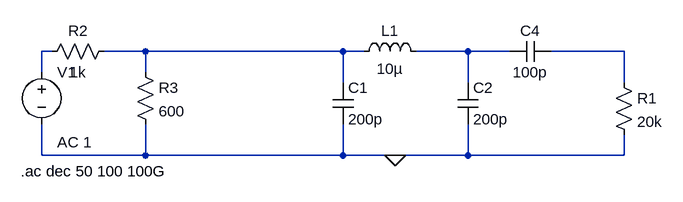
[diagram p0: schematic realim-colpits.asc]
realim-colpits.asc, the LTspice schematic file:
Version 4
SHEET 1 880 680
WIRE -320 64 -336 64
WIRE -176 64 -240 64
WIRE 128 64 -176 64
WIRE 160 64 128 64
WIRE 320 64 240 64
WIRE 384 64 320 64
WIRE 560 64 448 64
WIRE -336 96 -336 64
WIRE -176 96 -176 64
WIRE 128 112 128 64
WIRE 320 112 320 64
WIRE 560 112 560 64
WIRE -336 224 -336 176
WIRE -176 224 -176 176
WIRE -176 224 -336 224
WIRE 128 224 128 176
WIRE 128 224 -176 224
WIRE 208 224 128 224
WIRE 320 224 320 176
WIRE 320 224 208 224
WIRE 560 224 560 192
WIRE 560 224 320 224
FLAG 208 224 0
SYMBOL cap 112 112 R0
SYMATTR InstName C1
SYMATTR Value 200p
SYMBOL cap 304 112 R0
SYMATTR InstName C2
SYMATTR Value 200p
SYMBOL ind 144 80 R270
WINDOW 0 32 56 VTop 2
WINDOW 3 5 56 VBottom 2
SYMATTR InstName L1
SYMATTR Value 10µ
SYMBOL voltage -336 80 R0
WINDOW 123 24 124 Left 2
WINDOW 39 0 0 Left 0
SYMATTR Value2 AC 1
SYMATTR InstName V1
SYMATTR Value ""
SYMBOL cap 448 48 R90
WINDOW 0 0 32 VBottom 2
WINDOW 3 32 32 VTop 2
SYMATTR InstName C4
SYMATTR Value 100p
SYMBOL res 544 96 R0
SYMATTR InstName R1
SYMATTR Value 20k
SYMBOL res -224 48 R90
WINDOW 0 0 56 VBottom 2
WINDOW 3 32 56 VTop 2
SYMATTR InstName R2
SYMATTR Value 1k
SYMBOL res -192 80 R0
SYMATTR InstName R3
SYMATTR Value 600
TEXT -368 248 Left 2 !.ac dec 50 100 100G

The netlist it stands for:
* realim-colpits.asc
C1 N002 0 200p
C2 N003 0 200p
L1 N002 N003 10µ
V1 N001 0 AC 1
C4 N004 N003 100p
R1 N004 0 20k
R2 N002 N001 1k
R3 N002 0 600
.ac dec 50 100 100G
.backanno
.end